# Altium schematic sheet LevelTranslators.SchDoc: Shepherd - Level Translators
size A3; Author: Ingmar; CompanyName: NES Lab / TU Dresden; DocumentNumber: 6; SheetNumber: 6; SheetTotal: 8
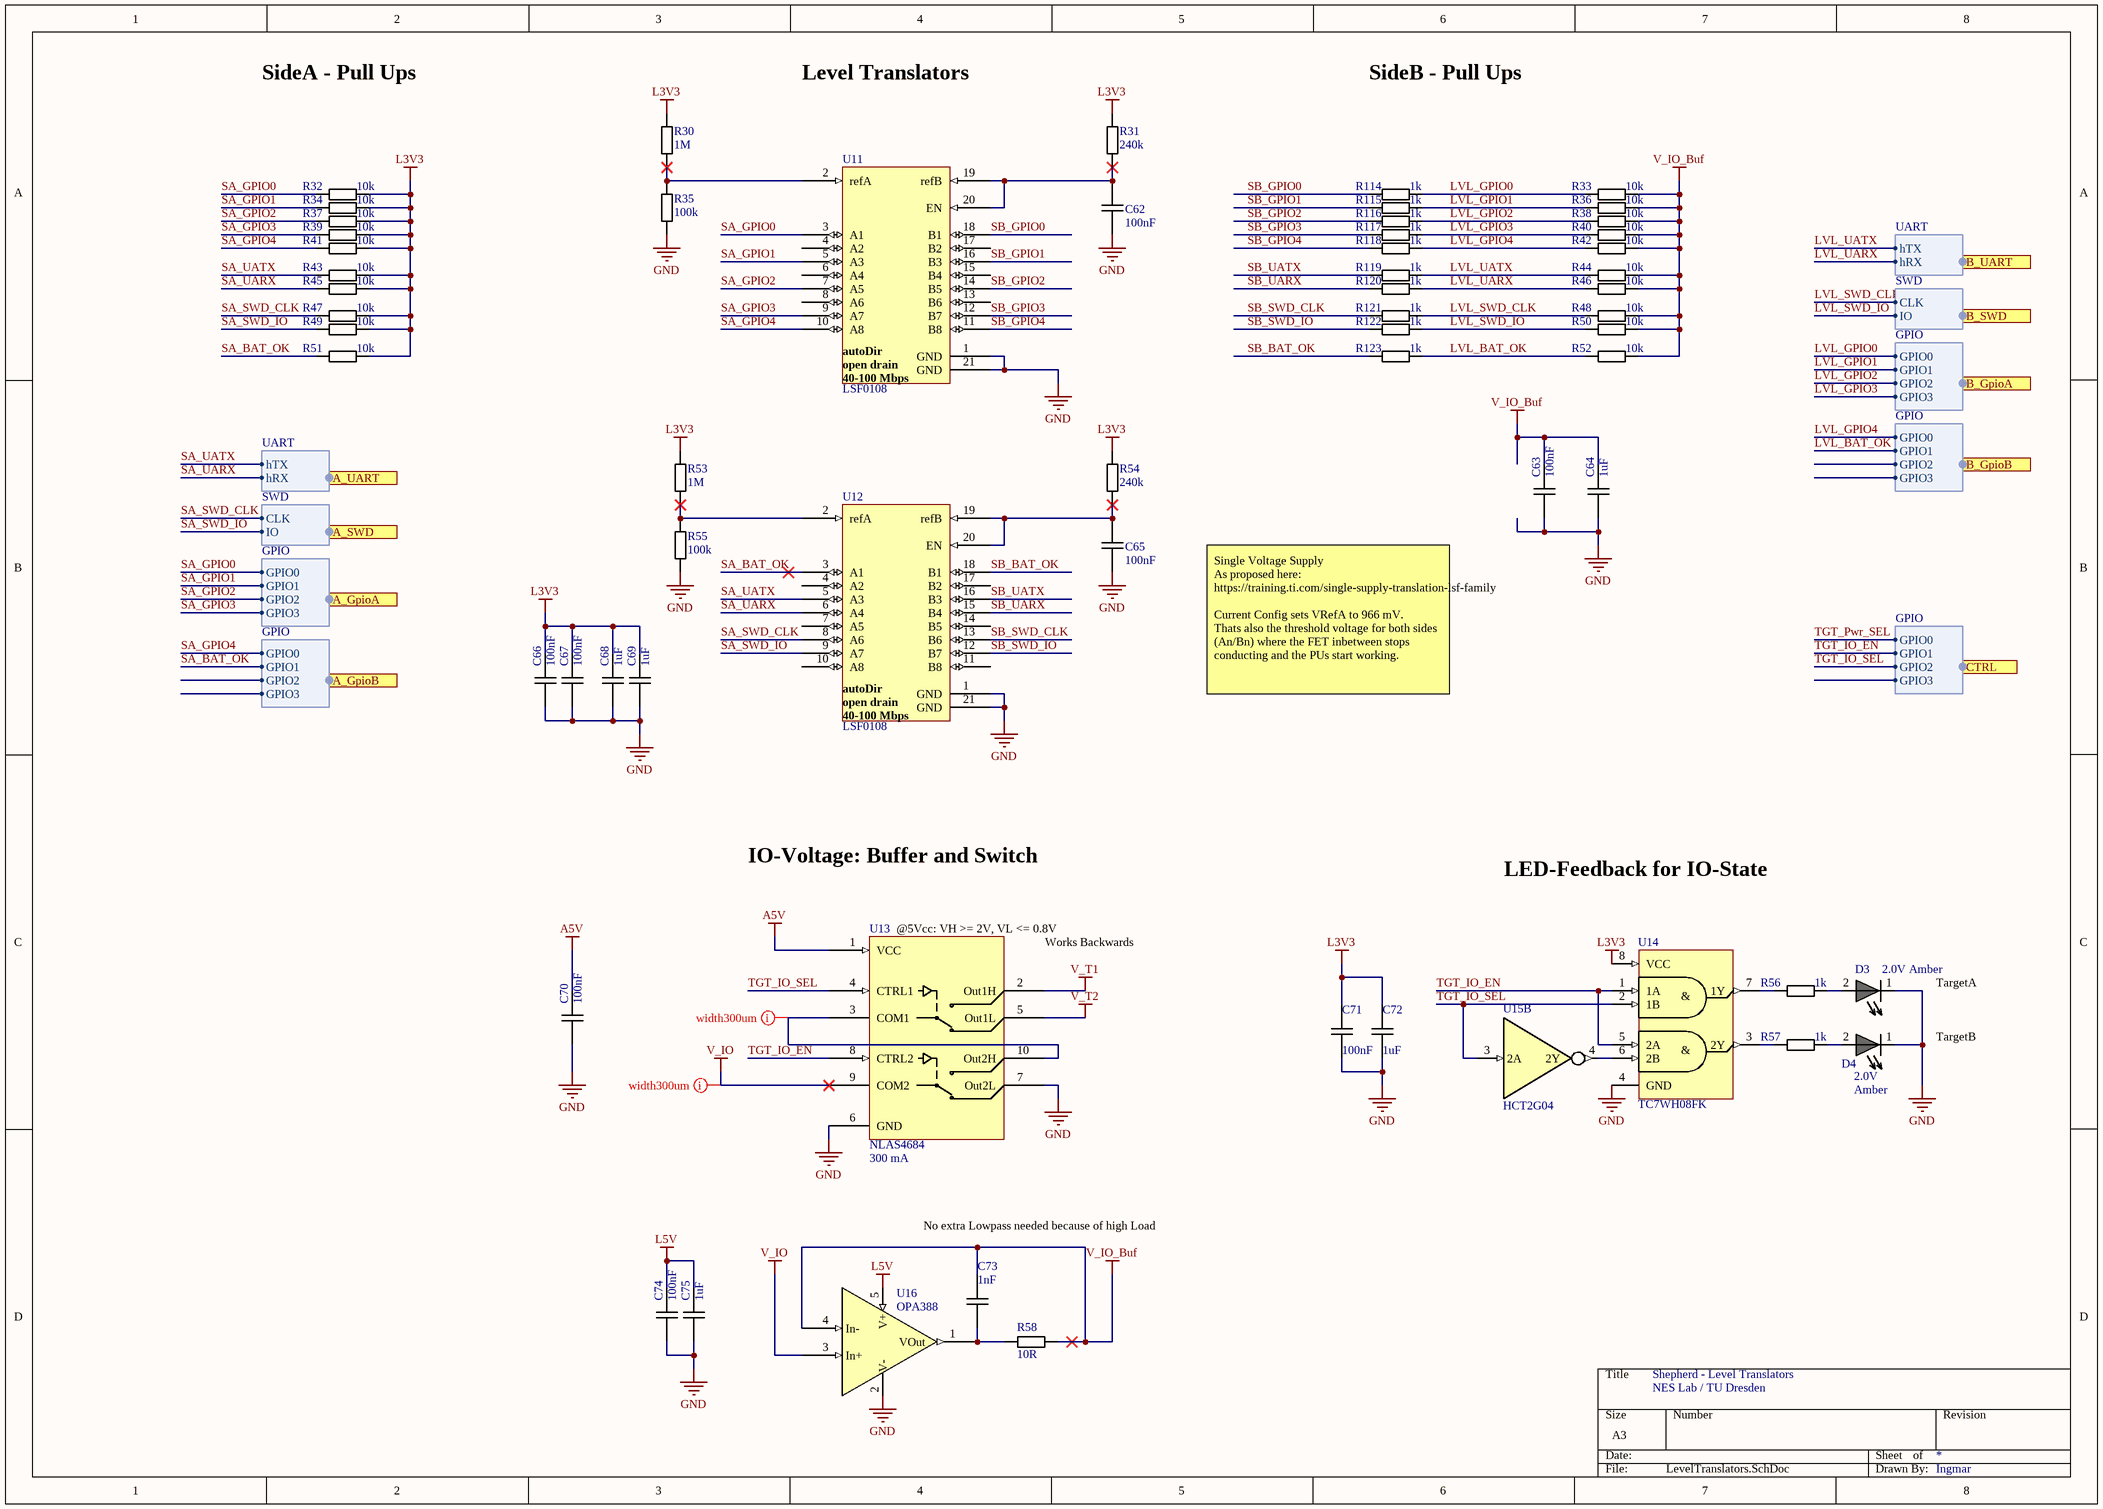
[diagram p0: LevelTranslators.SchDoc]

## Parts
C62  value 100nF  [CAPC1005X06]  (hidden comment: C_0402_100nF_16V)
C63  value 100nF  [CAPC1005X06]  (hidden comment: C_0402_100nF_16V)
C64  value 1uF  [CAPC1005X06]  (hidden comment: C_0402_1uF_25V)
C65  value 100nF  [CAPC1005X06]  (hidden comment: C_0402_100nF_16V)
C66  value 100nF  [CAPC1005X06]  (hidden comment: C_0402_100nF_16V)
C67  value 100nF  [CAPC1005X06]  (hidden comment: C_0402_100nF_16V)
C68  value 1uF  [CAPC1005X06]  (hidden comment: C_0402_1uF_25V)
C69  value 1uF  [CAPC1005X06]  (hidden comment: C_0402_1uF_25V)
C70  value 100nF  [CAPC1005X06]  (hidden comment: C_0402_100nF_16V)
C71  value 100nF  [CAPC1005X06]  (hidden comment: C_0402_100nF_16V)
C72  value 1uF  [CAPC1005X06]  (hidden comment: C_0402_1uF_25V)
C73  value 1nF  [CAPC1005X06]  (hidden comment: C_0402_1nF_50V)
C74  value 100nF  [CAPC1005X06]  (hidden comment: C_0402_100nF_16V)
C75  value 1uF  [CAPC1005X06]  (hidden comment: C_0402_1uF_25V)
D3  value Amber  V_max: 2.0V  [DIOM1608X02N Orange]  (hidden comment: D_LED_0603_Amber)
D4  value Amber  V_max: 2.0V  [DIOM1608X02N Orange]  (hidden comment: D_LED_0603_Amber)
R30  value 1M  [RESC1005X04]  (hidden comment: R_0402_1M)
R31  value 240k  [RESC1005X04]  (hidden comment: R_0402_240k_1%)
R32  value 10k  [RESC1005X04]  (hidden comment: R_0402_10k)
R33  value 10k  [RESC1005X04]  (hidden comment: R_0402_10k)
R34  value 10k  [RESC1005X04]  (hidden comment: R_0402_10k)
R35  value 100k  [RESC1005X04]  (hidden comment: R_0402_100k_1%)
R36  value 10k  [RESC1005X04]  (hidden comment: R_0402_10k)
R37  value 10k  [RESC1005X04]  (hidden comment: R_0402_10k)
R38  value 10k  [RESC1005X04]  (hidden comment: R_0402_10k)
R39  value 10k  [RESC1005X04]  (hidden comment: R_0402_10k)
R40  value 10k  [RESC1005X04]  (hidden comment: R_0402_10k)
R41  value 10k  [RESC1005X04]  (hidden comment: R_0402_10k)
R42  value 10k  [RESC1005X04]  (hidden comment: R_0402_10k)
R43  value 10k  [RESC1005X04]  (hidden comment: R_0402_10k)
R44  value 10k  [RESC1005X04]  (hidden comment: R_0402_10k)
R45  value 10k  [RESC1005X04]  (hidden comment: R_0402_10k)
R46  value 10k  [RESC1005X04]  (hidden comment: R_0402_10k)
R47  value 10k  [RESC1005X04]  (hidden comment: R_0402_10k)
R48  value 10k  [RESC1005X04]  (hidden comment: R_0402_10k)
R49  value 10k  [RESC1005X04]  (hidden comment: R_0402_10k)
R50  value 10k  [RESC1005X04]  (hidden comment: R_0402_10k)
R51  value 10k  [RESC1005X04]  (hidden comment: R_0402_10k)
R52  value 10k  [RESC1005X04]  (hidden comment: R_0402_10k)
R53  value 1M  [RESC1005X04]  (hidden comment: R_0402_1M)
R54  value 240k  [RESC1005X04]  (hidden comment: R_0402_240k_1%)
R55  value 100k  [RESC1005X04]  (hidden comment: R_0402_100k_1%)
R56  value 1k  [RESC1005X04]  (hidden comment: R_0402_1k)
R57  value 1k  [RESC1005X04]  (hidden comment: R_0402_1k)
R58  value 10R  [RESC1005X04]  (hidden comment: R_0402_10R)
R114  value 1k  [RESC1005X04]  (hidden comment: R_0402_1k)
R115  value 1k  [RESC1005X04]  (hidden comment: R_0402_1k)
R116  value 1k  [RESC1005X04]  (hidden comment: R_0402_1k)
R117  value 1k  [RESC1005X04]  (hidden comment: R_0402_1k)
R118  value 1k  [RESC1005X04]  (hidden comment: R_0402_1k)
R119  value 1k  [RESC1005X04]  (hidden comment: R_0402_1k)
R120  value 1k  [RESC1005X04]  (hidden comment: R_0402_1k)
R121  value 1k  [RESC1005X04]  (hidden comment: R_0402_1k)
R122  value 1k  [RESC1005X04]  (hidden comment: R_0402_1k)
R123  value 1k  [RESC1005X04]  (hidden comment: R_0402_1k)
U11  LSF0108  [QFN50P250X450X100_HS-21N]
U12  LSF0108  [QFN50P250X450X100_HS-21N]
U13  NLAS4684  I_max: 300 mA  [PSON50P300X100_HS-11N]
U14  TC7WH08FK  [TSSOP50P310X80-8N]
U15  HCT2G04  [SOT65P210X110-6N]  (part B of 2)
U16  OPA388  [SOT95P280X145-5N]

## Ports
A_GpioA (in, harness GPIO), A_GpioB (in, harness GPIO), A_SWD (in, harness SWD), A_UART (in, harness UART), B_GpioA (in, harness GPIO), B_GpioB (in, harness GPIO), B_SWD (in, harness SWD), B_UART (in, harness UART), CTRL (in, harness GPIO)

## Harnesses
GPIO: GPIO0, GPIO1, GPIO2, GPIO3
SWD: CLK, IO
UART: hTX, hRX

## Nets
A5V: C70.2 U13.1(VCC)
GND: C62.1 C63.1 C64.1 C65.1 C66.1 C67.1 C68.1 C69.1 C70.1 C71.1 C72.1 C74.1 C75.1 D3.1 D4.1 R35.2 R55.2 U11.1(GND) U11.21(GND) U12.1(GND) U12.21(GND) U13.6(GND) U13.7(Out2L) U14.4(GND) U16.2(V-)
L3V3: C66.2 C67.2 C68.2 C69.2 C71.2 C72.2 R30.2 R31.2 R32.2 R34.2 R37.2 R39.2 R41.2 R43.2 R45.2 R47.2 R49.2 R51.2 R53.2 R54.2 U14.8(VCC)
L5V: C74.2 C75.2 U16.5(V+)
V_IO: U13.9(COM2) U16.3(In+)
V_IO_Buf: C63.2 C64.2 C73.2 R33.2 R36.2 R38.2 R40.2 R42.2 R44.2 R46.2 R48.2 R50.2 R52.2 R58.2 U16.4(In-)
V_T1: U13.2(Out1H)
V_T2: U13.5(Out1L)
LVL_BAT_OK: R52.1 R123.2 ; port B_GpioB.GPIO1
LVL_GPIO0: R33.1 R114.2 ; port B_GpioA.GPIO0
LVL_GPIO1: R36.1 R115.2 ; port B_GpioA.GPIO1
LVL_GPIO2: R38.1 R116.2 ; port B_GpioA.GPIO2
LVL_GPIO3: R40.1 R117.2 ; port B_GpioA.GPIO3
LVL_GPIO4: R42.1 R118.2 ; port B_GpioB.GPIO0
LVL_SWD_CLK: R48.1 R121.2 ; port B_SWD.CLK
LVL_SWD_IO: R50.1 R122.2 ; port B_SWD.IO
LVL_UARX: R46.1 R120.2 ; port B_UART.hRX
LVL_UATX: R44.1 R119.2 ; port B_UART.hTX
SA_BAT_OK: R51.1 U12.3(A1) ; port A_GpioB.GPIO1
SA_GPIO0: R32.1 U11.3(A1) ; port A_GpioA.GPIO0
SA_GPIO1: R34.1 U11.5(A3) ; port A_GpioA.GPIO1
SA_GPIO2: R37.1 U11.7(A5) ; port A_GpioA.GPIO2
SA_GPIO3: R39.1 U11.9(A7) ; port A_GpioA.GPIO3
SA_GPIO4: R41.1 U11.10(A8) ; port A_GpioB.GPIO0
SA_SWD_CLK: R47.1 U12.8(A6) ; port A_SWD.CLK
SA_SWD_IO: R49.1 U12.9(A7) ; port A_SWD.IO
SA_UARX: R45.1 U12.6(A4) ; port A_UART.hRX
SA_UATX: R43.1 U12.5(A3) ; port A_UART.hTX
SB_BAT_OK: R123.1 U12.18(B1)
SB_GPIO0: R114.1 U11.18(B1)
SB_GPIO1: R115.1 U11.16(B3)
SB_GPIO2: R116.1 U11.14(B5)
SB_GPIO3: R117.1 U11.12(B7)
SB_GPIO4: R118.1 U11.11(B8)
SB_SWD_CLK: R121.1 U12.13(B6)
SB_SWD_IO: R122.1 U12.12(B7)
SB_UARX: R120.1 U12.15(B4)
SB_UATX: R119.1 U12.16(B3)
TGT_IO_EN: U13.8(CTRL2) U14.1(1A) U14.5(2A) ; port CTRL.GPIO1
TGT_IO_SEL: U13.4(CTRL1) U14.2(1B) U15.3(2A) ; port CTRL.GPIO2
TGT_Pwr_SEL: port CTRL.GPIO0
NetC62_2: C62.2 R31.1 U11.19(refB) U11.20(EN)
NetC65_2: C65.2 R54.1 U12.19(refB) U12.20(EN)
NetC73_1: C73.1 R58.1 U16.1(VOut)
NetD3_2: D3.2 R56.2
NetD4_2: D4.2 R57.2
NetR30_1: R30.1 R35.1 U11.2(refA)
NetR53_1: R53.1 R55.1 U12.2(refA)
NetR56_1: R56.1 U14.7(1Y)
NetR57_1: R57.1 U14.3(2Y)
NetU13_3: U13.3(COM1) U13.10(Out2H)
NetU14_6: U14.6(2B) U15.4(2Y)

Not connected (* = marked no-connect by the designer): U11 4(A2) 6(A4) 8(A6) 13(B6) 15(B4) 17(B2); U12 4(A2) 7(A5) 10(A8) 11(B8) 14(B5) 17(B2)

## Layout directives
rule Width Constraint [Pref Width = 0.3mm    Min Width = 0.3mm    Max Width = 1mm]: NetU13_3, V_IO

## Notes on the sheet
- SideA - Pull Ups
- Level Translators
- SideB - Pull Ups
- Single Voltage Supply
  As proposed here: https://training.ti.com/single-supply-translation-lsf-family
  Current Config sets VRefA to 966 mV.
  Thats also the threshold voltage for both sides (An/Bn) where the FET inbetween stops conducting and the PUs start working.
- IO-Voltage: Buffer and Switch
- LED-Feedback for IO-State
- (near U13) @5Vcc: VH >= 2V, VL <= 0.8V
- (near U13) Works Backwards
- TargetA
- TargetB
- No extra Lowpass needed because of high Load
- (in symbol LSF0108) autoDir / open drain / 40-100 Mbps
- (in symbol TC7WH08FK) &

## Library data of the parts
C62 C63 C65-C67 C70 C71 C74 = .C_0402_100nF_16V: Capacitor; Manufacturer: Taiyo Yuden; Manufacturer PN: EMF105B7104MVHF; V_max: 16V; Tolerance: 20%; Dielectric: X7R; Distributer: Mouser; Distributer PN: 963-EMF105B7104MVHF; Price n10 [€]: 0.03
C64 C68 C69 C72 C75 = .C_0402_1uF_25V: Capacitor; Manufacturer: Murata; Manufacturer PN: GRM155R61E105KA12J; V_max: 25V; Tolerance: 10%; Dielectric: X5R; Distributer: Mouser; Distributer PN: 81-GRM155R61E105KA2J; Price n10 [€]: 0.06
C73 = .C_0402_1nF_50V: Capacitor; Manufacturer: Murata; Manufacturer PN: GRM1555C1H102JA01D; V_max: 50V; Tolerance: 5%; Dielectric: C0G; Distributer: Mouser; Distributer PN: 81-GRM1555C1H102JA1D; Price n10 [€]: 0.02
D3 D4 = .D_LED_0603_Amber: LED Amber 610nm, 0603, 130 mcd, 2V@20mA; Manufacturer: Wuerth; Manufacturer PN: 150060AS75000; I_max: 20mA; I_typ: 5mA; V_typ: 1.9V; Distributer: Mouser; Distributer PN: 710-150060AS75000; Price n10 [€]: 0.12
R30 R53 = .R_0402_1M: Resistor; Manufacturer: Panasonic; Manufacturer PN: ERJ-2GEJ105X; P_max: 100mW; V_max: 50V; Tolerance: 5%; Distributer: Mouser; Distributer PN: 667-ERJ-2GEJ105X; Price n10 [€]: 0.02
R31 R54 = .R_0402_240k_1%: Resistor 100ppm/C; Manufacturer: Panasonic; Manufacturer PN: ERJ-2RKF2403X; P_max: 100mW; V_max: 50V; Tolerance: 1%; Distributer: Mouser; Distributer PN: 667-ERJ-2RKF2403X; Price n10 [€]: 0.02
R32-R34 R36-R52 = .R_0402_10k: Resistor; Manufacturer: Panasonic; Manufacturer PN: ERJ-2GEJ103X; P_max: 100mW; V_max: 50V; Tolerance: 5%; Distributer: Mouser; Distributer PN: 667-ERJ-2GEJ103X; Price n10 [€]: 0.02
R35 R55 = .R_0402_100k: Resistor; Manufacturer: Panasonic; Manufacturer PN: ERJ-2RKF1003X; P_max: 100mW; V_max: 50V; Tolerance: 1%; Distributer: Mouser; Distributer PN: 667-ERJ-2RKF1003X; Price n10 [€]: 0.02
R56 R57 R114-R123 = .R_0402_1k: Resistor; Manufacturer: Panasonic; Manufacturer PN: ERJ-2GEJ102X; P_max: 100mW; V_max: 50V; Tolerance: 5%; Distributer: Mouser; Distributer PN: 667-ERJ-2GEJ102X; Price n10 [€]: 0.02
R58 = .R_0402_10R: Resistor; Manufacturer: Panasonic; Manufacturer PN: ERJ-2GEJ100X; P_max: 100mW; V_max: 50V; Tolerance: 5%; Distributer: Mouser; Distributer PN: 667-ERJ-2GEJ100X; Price n10 [€]: 0.02
U11 U12 = LSF0108: Level Translator, 8CH, auto direction sensing, open drain, VCCA 1.2-3.6V, VCCB 1.65-5.5V, 40-110 Mbps, 1-5uA leakage; Manufacturer: Nexperia; Manufacturer PN: LSF0108BQX; V_max: 5V; V_min: 0.95V; Distributer: Mouser; Distributer PN: 771-LSF0108BQX; Price n10 [€]: 0.59
U13 = NLAS4684-MN: Analog Switch, Dual SPDT, 500 mOhm Rds, 300 mA continuous, 500 mA peak, <10 nA Leakage (1 nA for -55 to 25°C); Manufacturer: ON Semi; Manufacturer PN: NLAS4684MNR2G; V_max: 5.5; V_min: 1.8V; Distributer: Mouser; Distributer PN: 863-NLAS4684MNR2G; Price n10 [€]: 0.63
U14 = TC7WH08FK: Logic Gate, 2-Channel 2-Input AND Gate, 25 mA IOut max, SMALLER; Manufacturer: Toshiba; Manufacturer PN: TC7WH08FK,LJ(CT; I_max: 40uA; V_max: 5.5V; V_min: 2V; Distributer: Mouser; Distributer PN: 757-TC7WH08FKLJCT; Price n10 [€]: 0.24
U15 = HCT2G04: Inverter Dual, Buffered, I_out +- 25mA max,; Manufacturer: Nexperia; Manufacturer PN: 74HC2G04GW,125; V_max: 6.0V; V_min: 2.0V; I_max: 400uA; Distributer: Mouser; Distributer PN: 771-HC2G04GW125; Price n10 [€]: 0.21
U16 = OPA388-DBV: OpAmp High Precision, 30-60 mA perm, 5 V/us Slew, 7 nV/sqrtHz NoiseDist, 0.25 uV Offset, Z_id 100 MOhm, Z_ic 60 TOhm; Manufacturer: TI; Manufacturer PN: OPA388IDBVR; V_max: 5.5V; V_min: 2.5V; Distributer: Mouser; Distributer PN: 595-OPA388IDBVR; Price n10 [€]: 1.80